# EAGLE schematic irrigation shield (EAGLE 7.2.0)
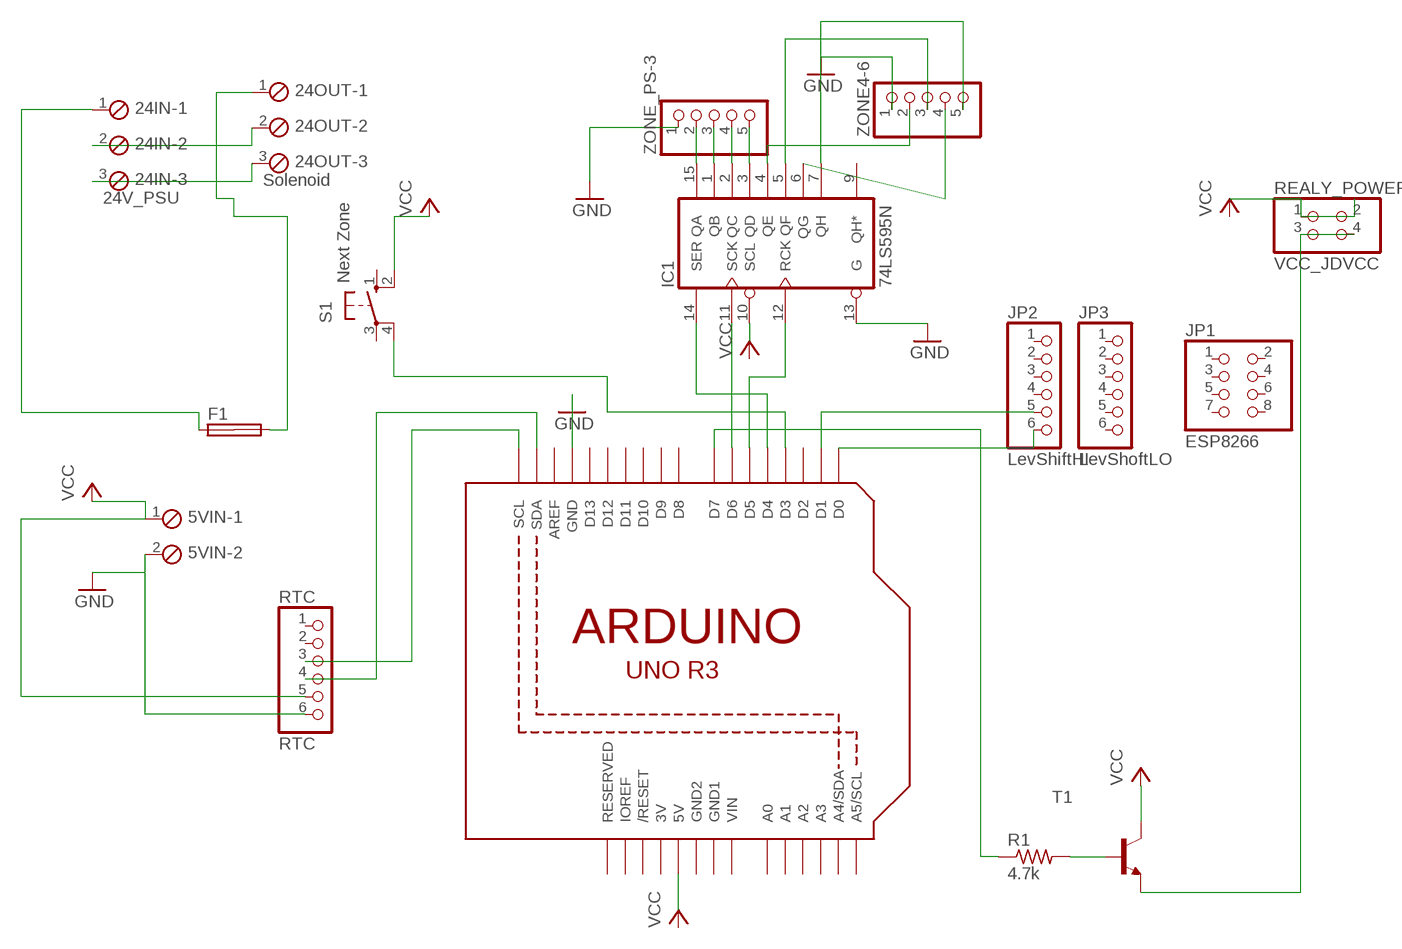
[diagram p0: schematic, sheet 1]

## Parts
5VIN  MPT2  [2POL254]
24IN  24V_PSU  MPT3  [3POL254]
24OUT  Solenoid  MPT3  [3POL254]
F1  SH32  [SH35]
IC1  74LS595N  [DIL16]
JP1  ESP8266  PINHD-2X4  [2X04]
JP2  LevShiftHI  PINHD-1X6  [1X06]
JP3  LevShoftLO  PINHD-1X6  [1X06]
R1  4.7k  R-US_0207/7  [0207/7]
REALY_POWER  VCC_JDVCC  PINHD-2X2  [2X02]
RTC  RTC  PINHD-1X6/90  [1X06/90]
S1  Next Zone  10-XX  [B3F-10XX]
T1  -NPN-TO92  [TO92]
U1  ARDUINOR3-DIMENSION  [ARDUINOR3]
ZONE4-6  PINHD-1X5  [1X05]
ZONE_PS-3  PINHD-1X5  [1X05]

## Nets
GND: 5VIN.2 IC1.13(G) RTC.6 U1.GND ZONE4-6.1 ZONE_PS-3.1
N$1: IC1.11(SCK) U1.D6
N$2: IC1.12(RCK) U1.D5
N$3: IC1.14(SER) U1.D4
N$4: R1.2 T1.2(B)
N$5: R1.1 U1.D7
N$6: IC1.15(QA) ZONE_PS-3.2
N$7: IC1.1(QB) ZONE_PS-3.3
N$8: IC1.2(QC) ZONE_PS-3.4
N$9: IC1.3(QD) ZONE_PS-3.5
N$10: JP2.5 U1.D1
N$11: 24IN.1 F1.1A
N$12: REALY_POWER.3 REALY_POWER.4 T1.1(E)
N$13: IC1.4(QE) ZONE4-6.2
N$14: IC1.5(QF) ZONE4-6.3
N$15: IC1.6(QG) ZONE4-6.4
N$16: IC1.7(QH) ZONE4-6.5
N$17: REALY_POWER.1 REALY_POWER.2
N$18: 24OUT.1 F1.2A
N$19: 24IN.2 24OUT.2
N$20: 24IN.3 24OUT.3
N$21: RTC.4 U1.SDA
N$22: S1.4(P1) U1.D3
N$23: RTC.3 U1.SCL
N$24: JP2.6 U1.D0
VCC: 5VIN.1 IC1.10(SCL) RTC.5 S1.2(S1) T1.3(C) U1.5V
Unconnected: F1.1B F1.2B IC1.9(QH*) JP1.1 JP1.2 JP1.3 JP1.4 JP1.5 JP1.6 JP1.7 JP1.8 JP2.1 JP2.2 JP2.3 JP2.4 JP3.1 JP3.2 JP3.3 JP3.4 JP3.5 JP3.6 RTC.1 RTC.2 S1.1(S) S1.3(P) U1.A0 U1.A1 U1.A2 U1.A3 U1.A4(A4/SDA) U1.A5(A5/SCL) U1.AREF U1.D2 U1.D8 U1.D9 U1.D10 U1.D11 U1.D12 U1.D13 U1.IOREF U1.RESERVED U1.RESET(/RESET)

## Power pins joined to a net without a drawn wire
3V: U1.3V
GND: IC1.8(GND)
GND1: U1.GND1
GND2: U1.GND2
VCC: IC1.16(VCC)
VIN: U1.VIN

## Library data of the parts
5VIN = con-phoenix-254:MPT2: PHOENIX CONNECTOR; OC_FARNELL: unknown; OC_NEWARK: unknown
24IN 24OUT = con-phoenix-254:MPT3: PHOENIX CONNECTOR; OC_FARNELL: unknown; OC_NEWARK: unknown
F1 = fuse:SH32: FUSE HOLDER 6 x 32 mm, SH contact, SHH3N Schukat, 102071 Wickmann (Buerklin)
IC1 = 74xx-us:74*595: 8-bit SHIFT REGISTER, output latch
JP1 = adafruit:PINHD-2X4: PIN HEADER
JP2 JP3 = adafruit:PINHD-1X6: PIN HEADER
R1 = resistor:R-US_: RESISTOR, American symbol
REALY_POWER = pinhead:PINHD-2X2: PIN HEADER
RTC = pinhead:PINHD-1X6: PIN HEADER
S1 = switch-omron:10-XX: OMRON SWITCH; MPN: B3F-1000; OC_FARNELL: 176432; OC_NEWARK: 36M3542
T1 = transistor:*-NPN-: NPN Transistror BF959 corrected 2008.03.06
U1 = adafruit:ARDUINOR3: This is a new object for the new Arduino R3 - with extra pins that you may want to use (such as IOref, and duplicated A4/A5
ZONE4-6 ZONE_PS-3 = pinhead:PINHD-1X5: PIN HEADER